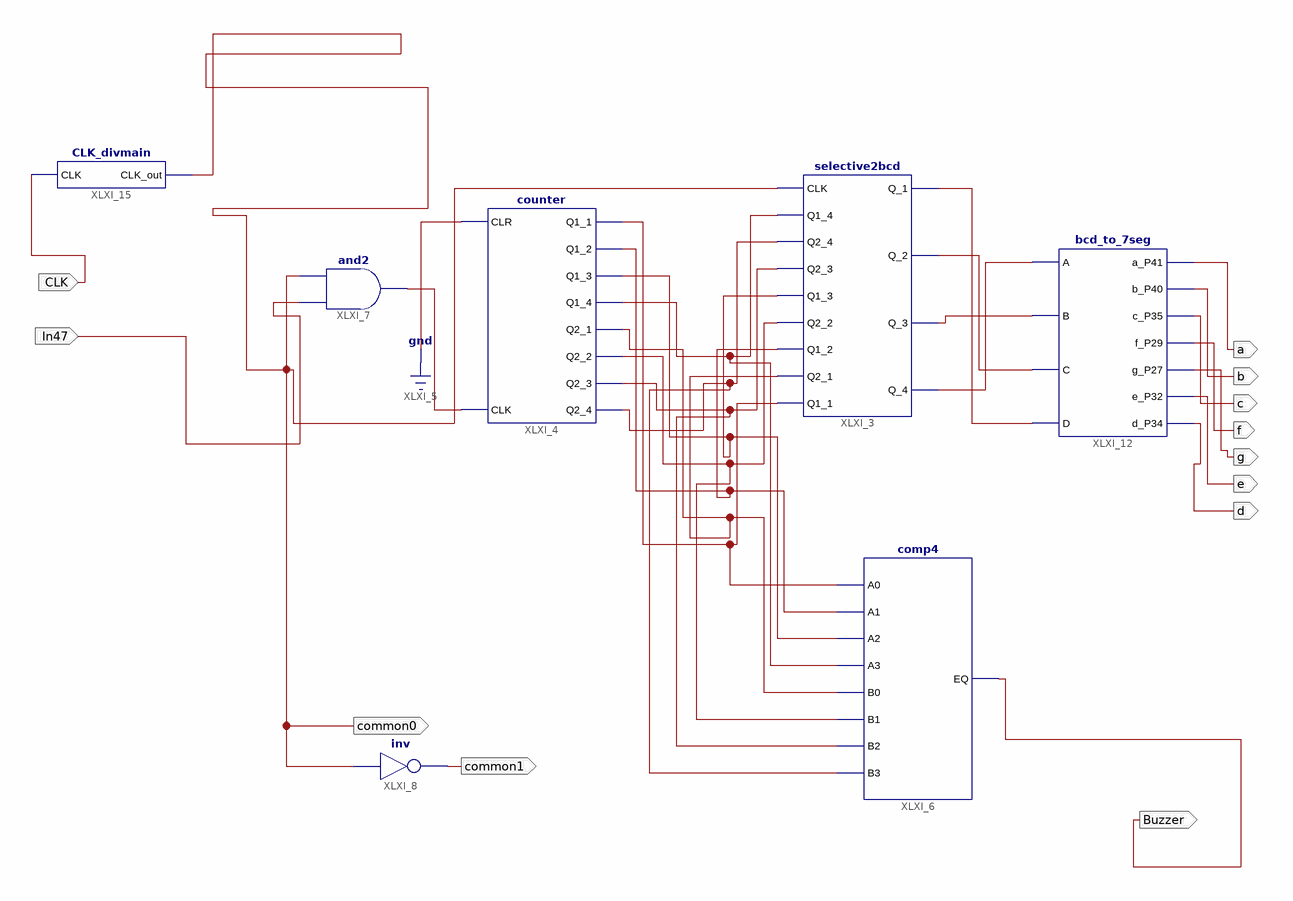
[diagram p0: schematic sheet 1]
// Xilinx ISE schematic main.sch (spartan6) as structural Verilog: 7 symbols, 12 ports
module main (
  input  CLK,
  input  In47,
  output common0,
  output common1,
  output Buzzer,
  output a,
  output b,
  output c,
  output f,
  output g,
  output e,
  output d
);

  wire XLXN_1, XLXN_2, XLXN_3, XLXN_4, XLXN_6, XLXN_7, XLXN_8, XLXN_9, XLXN_10, XLXN_11, XLXN_12, XLXN_28,
       XLXN_35;

  selective2bcd XLXI_3 (
    .CLK(common0), .Q1_4(XLXN_8), .Q2_4(XLXN_12), .Q2_3(XLXN_11), .Q1_3(XLXN_7), .Q2_2(XLXN_10),
    .Q1_2(XLXN_6), .Q2_1(XLXN_9), .Q1_1(XLXN_28), .Q_1(XLXN_1), .Q_2(XLXN_2), .Q_3(XLXN_3), .Q_4(XLXN_4));
  counter XLXI_4 (
    .CLR(1'b0), .CLK(XLXN_35), .Q1_1(XLXN_28), .Q1_2(XLXN_6), .Q1_3(XLXN_7), .Q1_4(XLXN_8), .Q2_1(XLXN_9),
    .Q2_2(XLXN_10), .Q2_3(XLXN_11), .Q2_4(XLXN_12));
  comp4 XLXI_6 (
    .A0(XLXN_28), .A1(XLXN_6), .A2(XLXN_7), .A3(XLXN_8), .B0(XLXN_9), .B1(XLXN_10), .B2(XLXN_11),
    .B3(XLXN_12), .EQ(Buzzer));
  and XLXI_7 (XLXN_35, In47, common0);
  not XLXI_8 (common1, common0);
  bcd_to_7seg XLXI_12 (
    .A(XLXN_4), .B(XLXN_3), .C(XLXN_2), .D(XLXN_1), .a_P41(a), .b_P40(b), .c_P35(c), .f_P29(f), .g_P27(g),
    .e_P32(e), .d_P34(d));
  CLK_divmain XLXI_15 (.CLK(CLK), .CLK_out(common0));

  // Notes on the sheet:
  //   LOC on signal CLK = P123
  //   LOC on signal common0 = P44
  //   LOC on signal In47 = P47
  //   LOC on signal common1 = P43
  //   LOC on signal Buzzer = P83
  //   LOC on signal a = P41
  //   LOC on signal b = P40
  //   LOC on signal c = P35
  //   LOC on signal f = P29
  //   LOC on signal g = P27
  //   LOC on signal e = P32
  //   LOC on signal d = P34
endmodule
